# Altium schematic sheet 03-ZYNQ BANK 500.SchDoc
size 513 x 386 mm
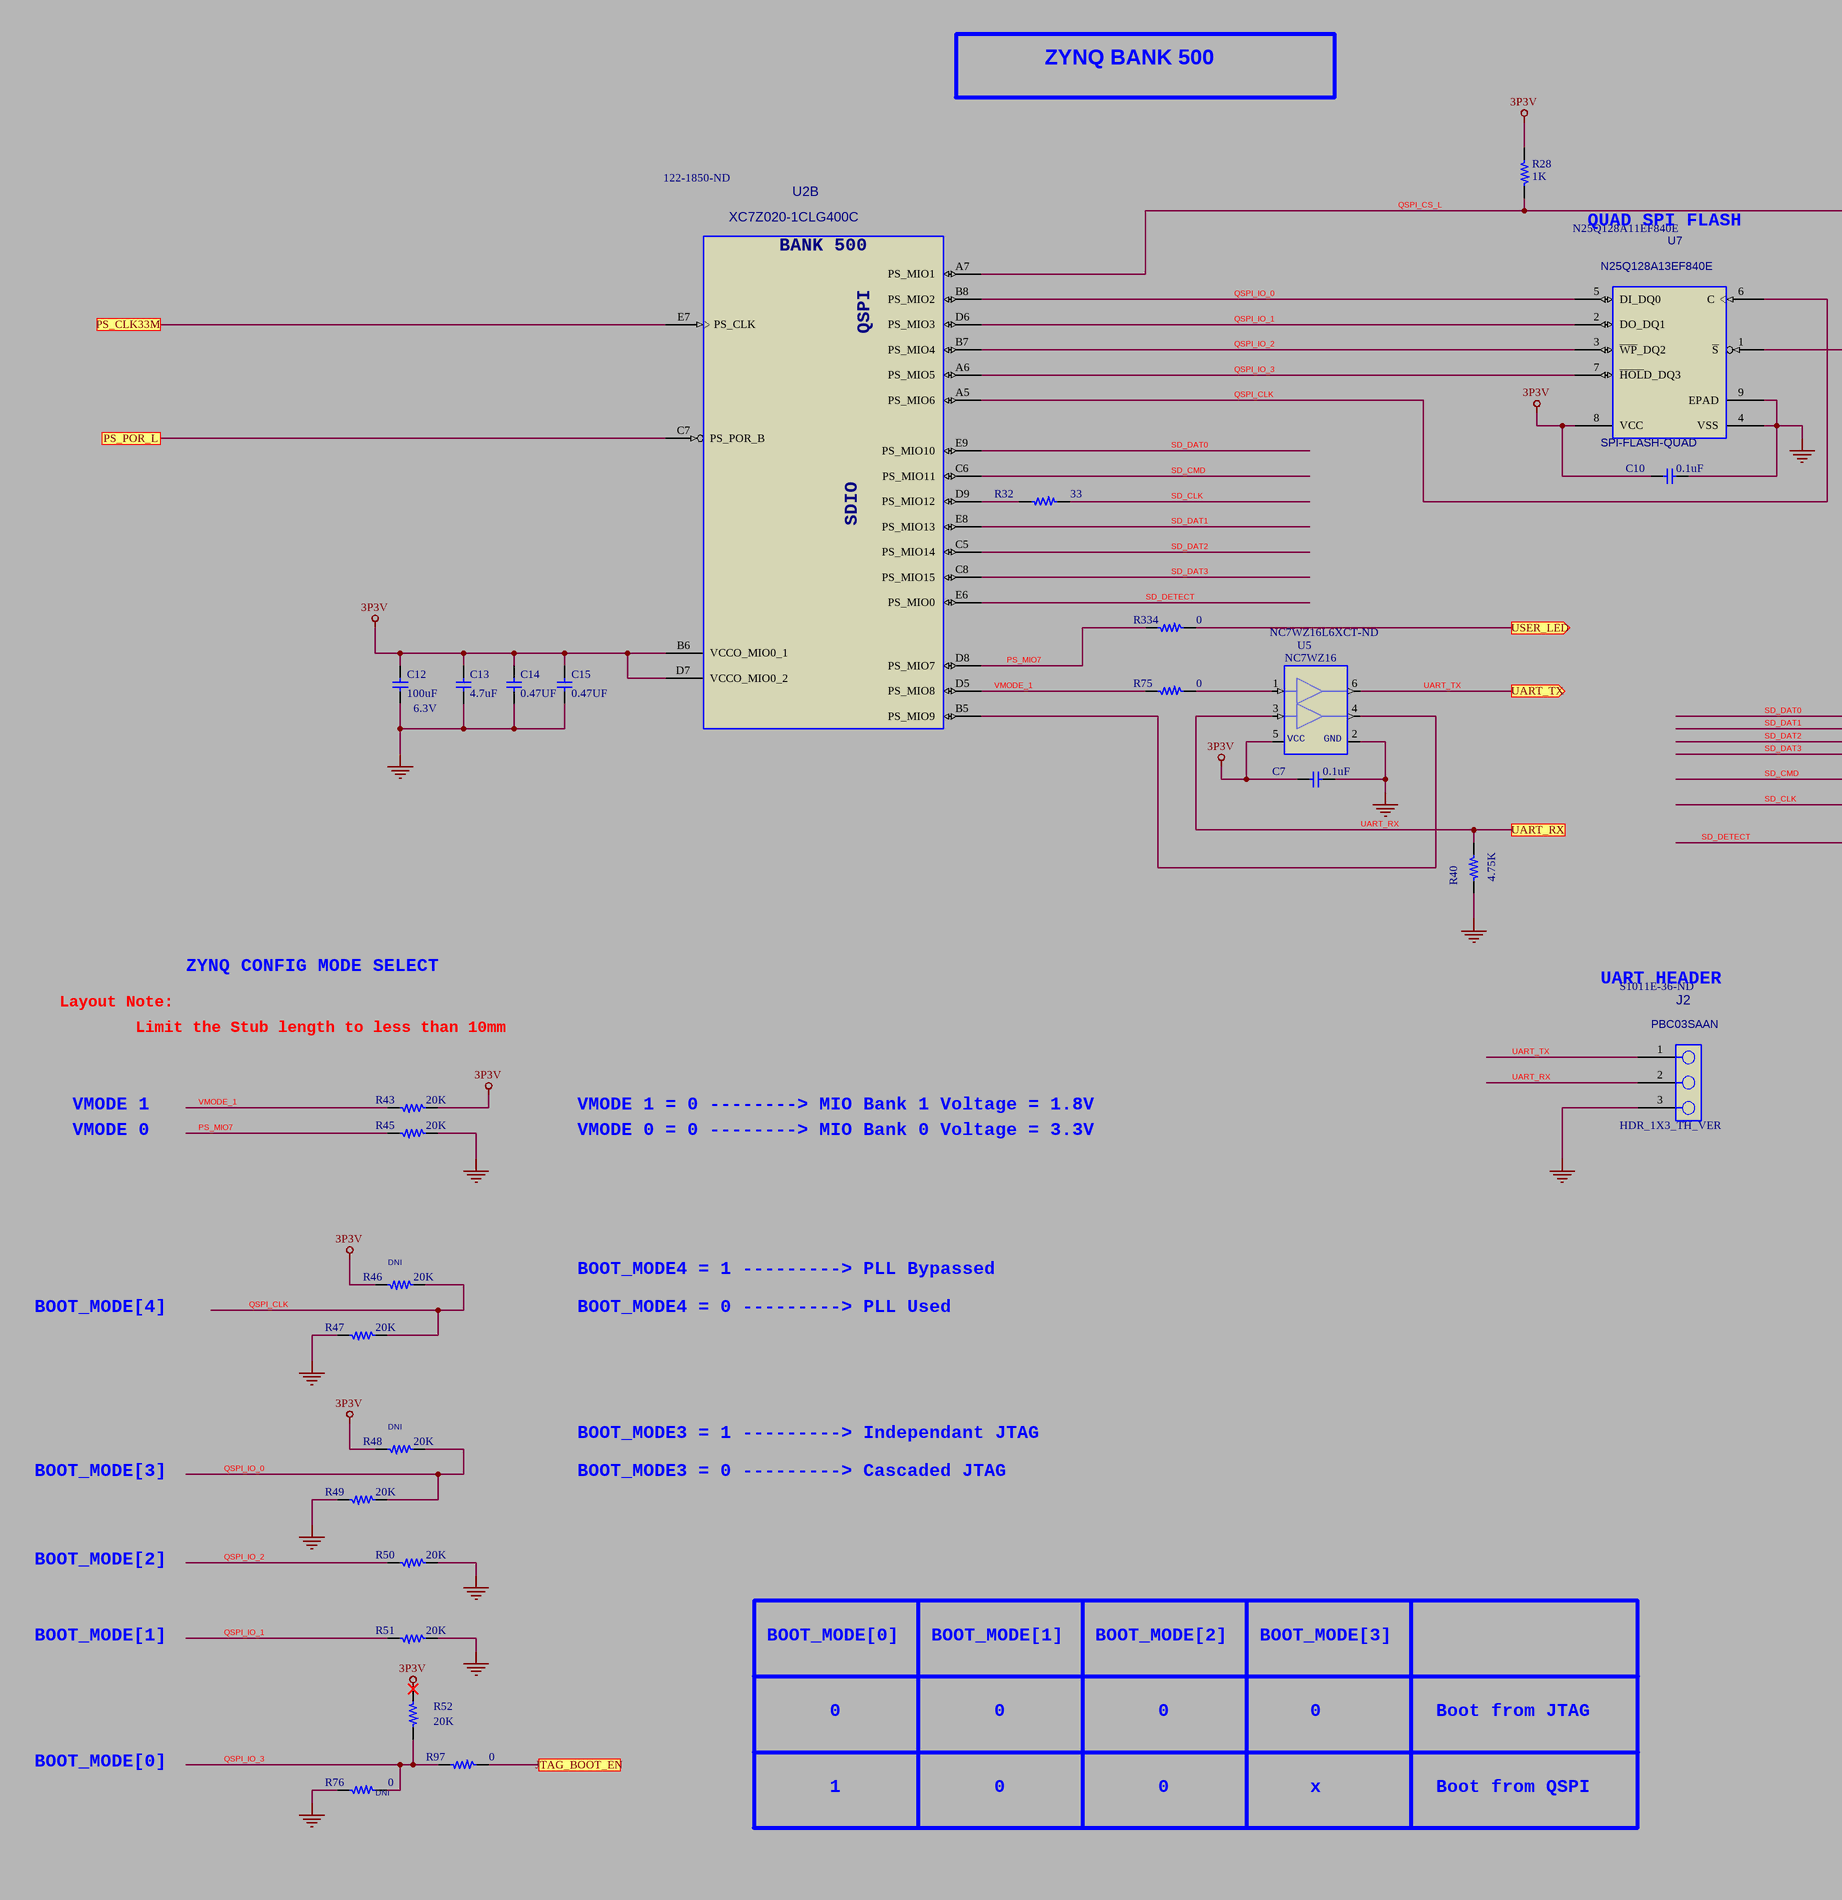
[diagram p0: 03-ZYNQ BANK 500.SchDoc, left]
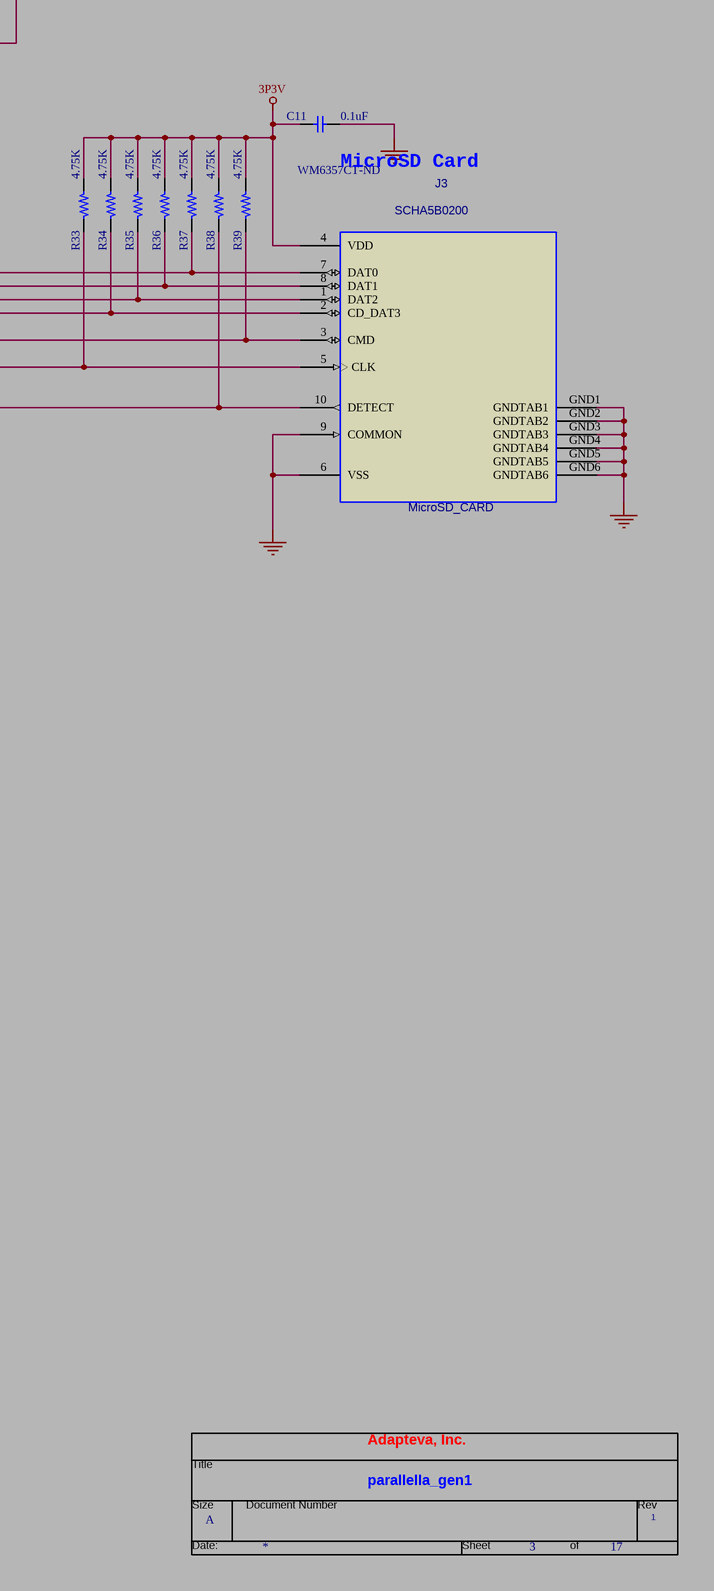
[diagram p1: 03-ZYNQ BANK 500.SchDoc, right]

## Parts
*  RevCode: 1  Title: parallella_gen1  Page Size: A  Page Number: 3  Page Count: 17  OrgAddr1: Adapteva, Inc.  (hidden comment: TitleBlock0)  (graphical)
C7  0.1uF  [C0402]
C10  0.1uF  [C0402]
C11  0.1uF  [C0402]
C12  100uF  VOLTAGE: 6.3V  [C1210]
C13  4.7uF  [C0402]
C14  0.47UF  [C0402]
C15  0.47UF  [C0402]
J2  HDR_1X3_TH_VER  Vendor PN: PBC03SAAN  Supplier Part Number 1: S1011E-36-ND  [HDR_1X3_TH_VER]
J3  MicroSD_CARD  Vendor PN: SCHA5B0200  Supplier Part Number 1: WM6357CT-ND  [SDMICRO_8PIN_REV_15SQX1P51MMH]
R28  1K  [R0402]
R32  33  [R0402]
R33  4.75K  [R0402]
R34  4.75K  [R0402]
R35  4.75K  [R0402]
R36  4.75K  [R0402]
R37  4.75K  [R0402]
R38  4.75K  [R0402]
R39  4.75K  [R0402]
R40  4.75K  [R0402]
R43  20K  [R0402]
R45  20K  [R0402]
R46  20K  INSTALL: DNI  [R0402]
R47  20K  [R0402]
R48  20K  INSTALL: DNI  [R0402]
R49  20K  [R0402]
R50  20K  [R0402]
R51  20K  [R0402]
R52  20K  [R0402]
R75  0  [R0402]
R76  0  INSTALL: DNI  [R0402]
R97  0  [R0402]
R334  0  [R0402]
U2  Vendor PN: XC7Z020-1CLG400C  Supplier Part Number 1: 122-1850-ND  [CBGA400_17SQ_1P6H_P8MMP]  (hidden comment: 7Z020-CLG400)  (part B of 8)
U5  NC7WZ16  Supplier Part Number 1: NC7WZ16L6XCT-ND  [SC_70_6PSMT]
U7  SPI-FLASH-QUAD  Vendor PN: N25Q128A13EF840E  Supplier Part Number 1: N25Q128A11EF840E  [VPDFN-8_6X8XP85H_1P27MMP]

## Ports
JTAG_BOOT_EN, PS_CLK33M, PS_POR_L, UART_RX, UART_TX (out), USER_LED (out)

## Nets
3P3V: C7.2 C10.2 C11.2 C12.1 C13.1 C14.1 C15.1 J3.4(VDD) R28.1 R33.2 R34.2 R35.2 R36.2 R37.2 R38.2 R39.2 R43.1 R46.2 R48.2 R52.1 U2.B6(VCCO_MIO0_1) U2.D7(VCCO_MIO0_2) U5.5(VCC) U7.8(VCC)
GND: C7.1 C10.1 C11.1 C12.2 C13.2 C14.2 C15.2 J2.3 J3.6(VSS) J3.9(COMMON) J3.GND1(GNDTAB1) J3.GND2(GNDTAB2) J3.GND3(GNDTAB3) J3.GND4(GNDTAB4) J3.GND5(GNDTAB5) J3.GND6(GNDTAB6) R40.1 R45.1 R47.2 R49.2 R50.1 R51.1 R76.1 U5.2(GND) U7.4(VSS) U7.9(EPAD)
JTAG_BOOT_EN: R97.2 ; port JTAG_BOOT_EN
PS_CLK33M: U2.E7(PS_CLK) ; port PS_CLK33M
PS_MIO7: R45.2 R334.1 U2.D8(PS_MIO7)
PS_POR_L: U2.C7(PS_POR_B) ; port PS_POR_L
QSPI_CLK: R46.1 R47.1 U2.A5(PS_MIO6) U7.6(C)
QSPI_CS_L: R28.2 U2.A7(PS_MIO1) U7.1(~{S})
QSPI_IO_0: R48.1 R49.1 U2.B8(PS_MIO2) U7.5(DI_DQ0)
QSPI_IO_1: R51.2 U2.D6(PS_MIO3) U7.2(DO_DQ1)
QSPI_IO_2: R50.2 U2.B7(PS_MIO4) U7.3(~{WP}_DQ2)
QSPI_IO_3: R52.2 R76.2 R97.1 U2.A6(PS_MIO5) U7.7(~{HOL}D_DQ3)
SD_CLK: J3.5(CLK) R32.2 R33.1
SD_CMD: J3.3(CMD) R39.1 U2.C6(PS_MIO11)
SD_DAT0: J3.7(DAT0) R37.1 U2.E9(PS_MIO10)
SD_DAT1: J3.8(DAT1) R36.1 U2.E8(PS_MIO13)
SD_DAT2: J3.1(DAT2) R35.1 U2.C5(PS_MIO14)
SD_DAT3: J3.2(CD_DAT3) R34.1 U2.C8(PS_MIO15)
SD_DETECT: J3.10(DETECT) R38.1 U2.E6(PS_MIO0)
UART_RX: J2.2 R40.2 U5.3(A2) ; port UART_RX
UART_TX: J2.1 U5.6(Y1) ; port UART_TX
USER_LED: R334.2 ; port USER_LED
VMODE_1: R43.2 R75.1 U2.D5(PS_MIO8)
NetR32_1: R32.1 U2.D9(PS_MIO12)
NetR75_2: R75.2 U5.1(A1)
NetU2_B5: U2.B5(PS_MIO9) U5.4(Y2)

## Notes on the sheet
- ZYNQ BANK 500
- QUAD SPI FLASH
- (near C11) MicroSD Card
- ZYNQ CONFIG MODE SELECT
- UART HEADER
- Layout Note:
- Limit the Stub length to less than 10mm
- VMODE 1
- VMODE 1 = 0 --------> MIO Bank 1 Voltage = 1.8V
- VMODE 0
- VMODE 0 = 0 --------> MIO Bank 0 Voltage = 3.3V
- BOOT_MODE4 = 1 ---------> PLL Bypassed
- BOOT_MODE[4]
- BOOT_MODE4 = 0 ---------> PLL Used
- BOOT_MODE[3]
- BOOT_MODE3 = 1 ---------> Independant JTAG
- BOOT_MODE3 = 0 ---------> Cascaded JTAG
- BOOT_MODE[2]
- BOOT_MODE[1]
- BOOT_MODE[0]
- 0
- Boot from JTAG
- 1
- x
- Boot from QSPI
- (in symbol TitleBlock0) Title; Size; Document Number; Rev; Date:; Sheet; of
- (in symbol ZYNQ_7Z020_CLG400, part B) BANK 500; QSPI; SDIO

## Library data of the parts
C7 C10 C11 = CAP0402_0P1UF_X5R_35V: CAP, 0402, 0.1UF, X5R, 35V; ALT_SYMBOLS: C0402_BGA; Vendor PN: GMK105BJ104KV-F; Vendor: TAIYO YUDEN; DEVICE: CAP0402_0P1UF_X5R_35V; MFG PART NO: GMK105BJ104KV-F; MFG: TAIYO YUDEN; PCB Footprint: C0402
C12 = CAP1210_100UF_X5R_LOESR: CAP, 1210, 100UF, X5R, 6.3V, LOW ESR; MFG PART NO: GRM32ER60J107ME20L; MFG: MURATA; DEVICE: CAP1210_100UF_X5R_LOESR; Vendor: MURATA; Vendor PN: GRM32ER60J107ME20L; PCB Footprint: C1210
C13 = CAP0402_4P7UF_X5R: CAP, 0402, 4.7UF, X5R, 6.3V; MFG PART NO: C1005X5R0J475K; MFG: TDK; ALT_SYMBOLS: C0402_BGA; DEVICE: CAP0402_4P7UF_X5R; Vendor: TDK; Vendor PN: C1005X5R0J475K; PCB Footprint: C0402
C14 C15 = CAP0402_0P47UF_X5R: CAP, 0402, 0.47UF, X5R, 16V; MFG PART NO: C1005X5R1C474K; MFG: TDK; ALT_SYMBOLS: C0402_BGA; DEVICE: CAP0402_0P47UF_X5R; Vendor: TDK; Vendor PN: C1005X5R1C474K; PCB Footprint: C0402
J2 = HDR_1X3_TH_VER_0.1P: HDR, 1ROW, 3POS, VERT, TH, 1X3, 0.100 PITCH; MFG PART NO: PBC36SAAN; Vendor: SULLINS; MFG: SULLINS; DEVICE: HDR_1X3_TH_VER_0.1P; PCB Footprint: HDR_1X3_TH_VER; Supplier 1: Digi-Key
J3 = CONN_MICROSD_CARD: CONN, MICRO SD CARD, PUSH-PUSH; Vendor: ALPS; DEVICE: CONN_MICROSD_CARD; MFG_PN: SCHA5B0200; MFG: ALPS; PCB Footprint: SDMICRO_8PIN_REV_15SQX1P51MMH; Supplier 1: Digi-Key
R28 = RES0402_1K: RES, 0402, 1K; MFG PART NO: CRCW04021K00FKED; ALT_SYMBOLS: R0402_BGA; MFG: VISHAY; Vendor: VISHAY/DALE; DEVICE: RES0402_1K; Vendor PN: CRCW04021K00FKED; PCB Footprint: R0402
R32 = RES0402_33: RES, 0402, 33, 1%; MFG PART NO: CRCW040233R0FKED; MFG: VISHAY; Vendor: VISHAY/DALE; ALT_SYMBOLS: R0402_BGA; DEVICE: RES0402_33; Vendor PN: CRCW040233R0FKED; PCB Footprint: R0402
R33-R40 = RES0402_4K75: RES, 0402, 4.75K, 1%; MFG PART NO: CRCW04024K75FKED; MFG: VISHAY; Vendor: VISHAY/DALE; ALT_SYMBOLS: R0402_BGA; DEVICE: RES0402_4K75; Vendor PN: CRCW04024K75FKED; PCB Footprint: R0402
R43 R45-R52 = RES0402_20K: RES, 0402, 20K; Vendor PN: CRCW040220K0FKED; Vendor: VISHAY/DALE; MFG: VISHAY; ALT_SYMBOLS: R0402_BGA; MFG PART NO: CRCW040220K0FKED; DEVICE: RES0402_20K; PCB Footprint: R0402
R75 R76 R97 R334 = RES0402_0: RES, 0402, 0 OHM, 1%; MFG PART NO: CRCW04020000Z0ED; ALT_SYMBOLS: R0402_BGA; MFG: VISHAY; Vendor: VISHAY/DALE; DEVICE: RES0402_0; Vendor PN: CRCW04020000Z0ED; PCB Footprint: R0402
U2 = ZYNQ_7Z020_CLG400: IC, EPP, XILINX, ZYNQ, 7Z020, CLG400; SPLIT_INST: TRUE; Vendor: XILINX; DEVICE: ZYNQ_7Z020_CLG400; PCB Footprint: CBGA400_17SQ_1P6H_P8MMP; Supplier 1: Digi-Key
U5 = NC7WZ16: MFG PART NO: NC7WZ16P6X; MFG: FAIRCHILD; DEVICE: NC7WZ16; Vendor: FAIRCHILD; Vendor PN: NC7WZ16P6X; PCB Footprint: SC_70_6PSMT; Supplier 1: Digi-Key
U7 = IC_SPI_FLASH_QUAD_128Mb: SPI FLASH, QUAD, 128M-BIT, VPDFN8, 1.8V; MFG: MICRON; MFG PART NO: N25Q128A11EF840E; Vendor: MICRON; DEVICE: IC_SPI_FLASH_QUAD_128Mb; PCB Footprint: VPDFN-8_6X8XP85H_1P27MMP; Supplier 1: Arrow
* = TitleBlock0: Page Create Date: March  8, 1995; Page Modify Date: *